# EAGLE schematic ModuleCarrier-xDot (EAGLE 7.7.0)

## Sheet 1 of 2
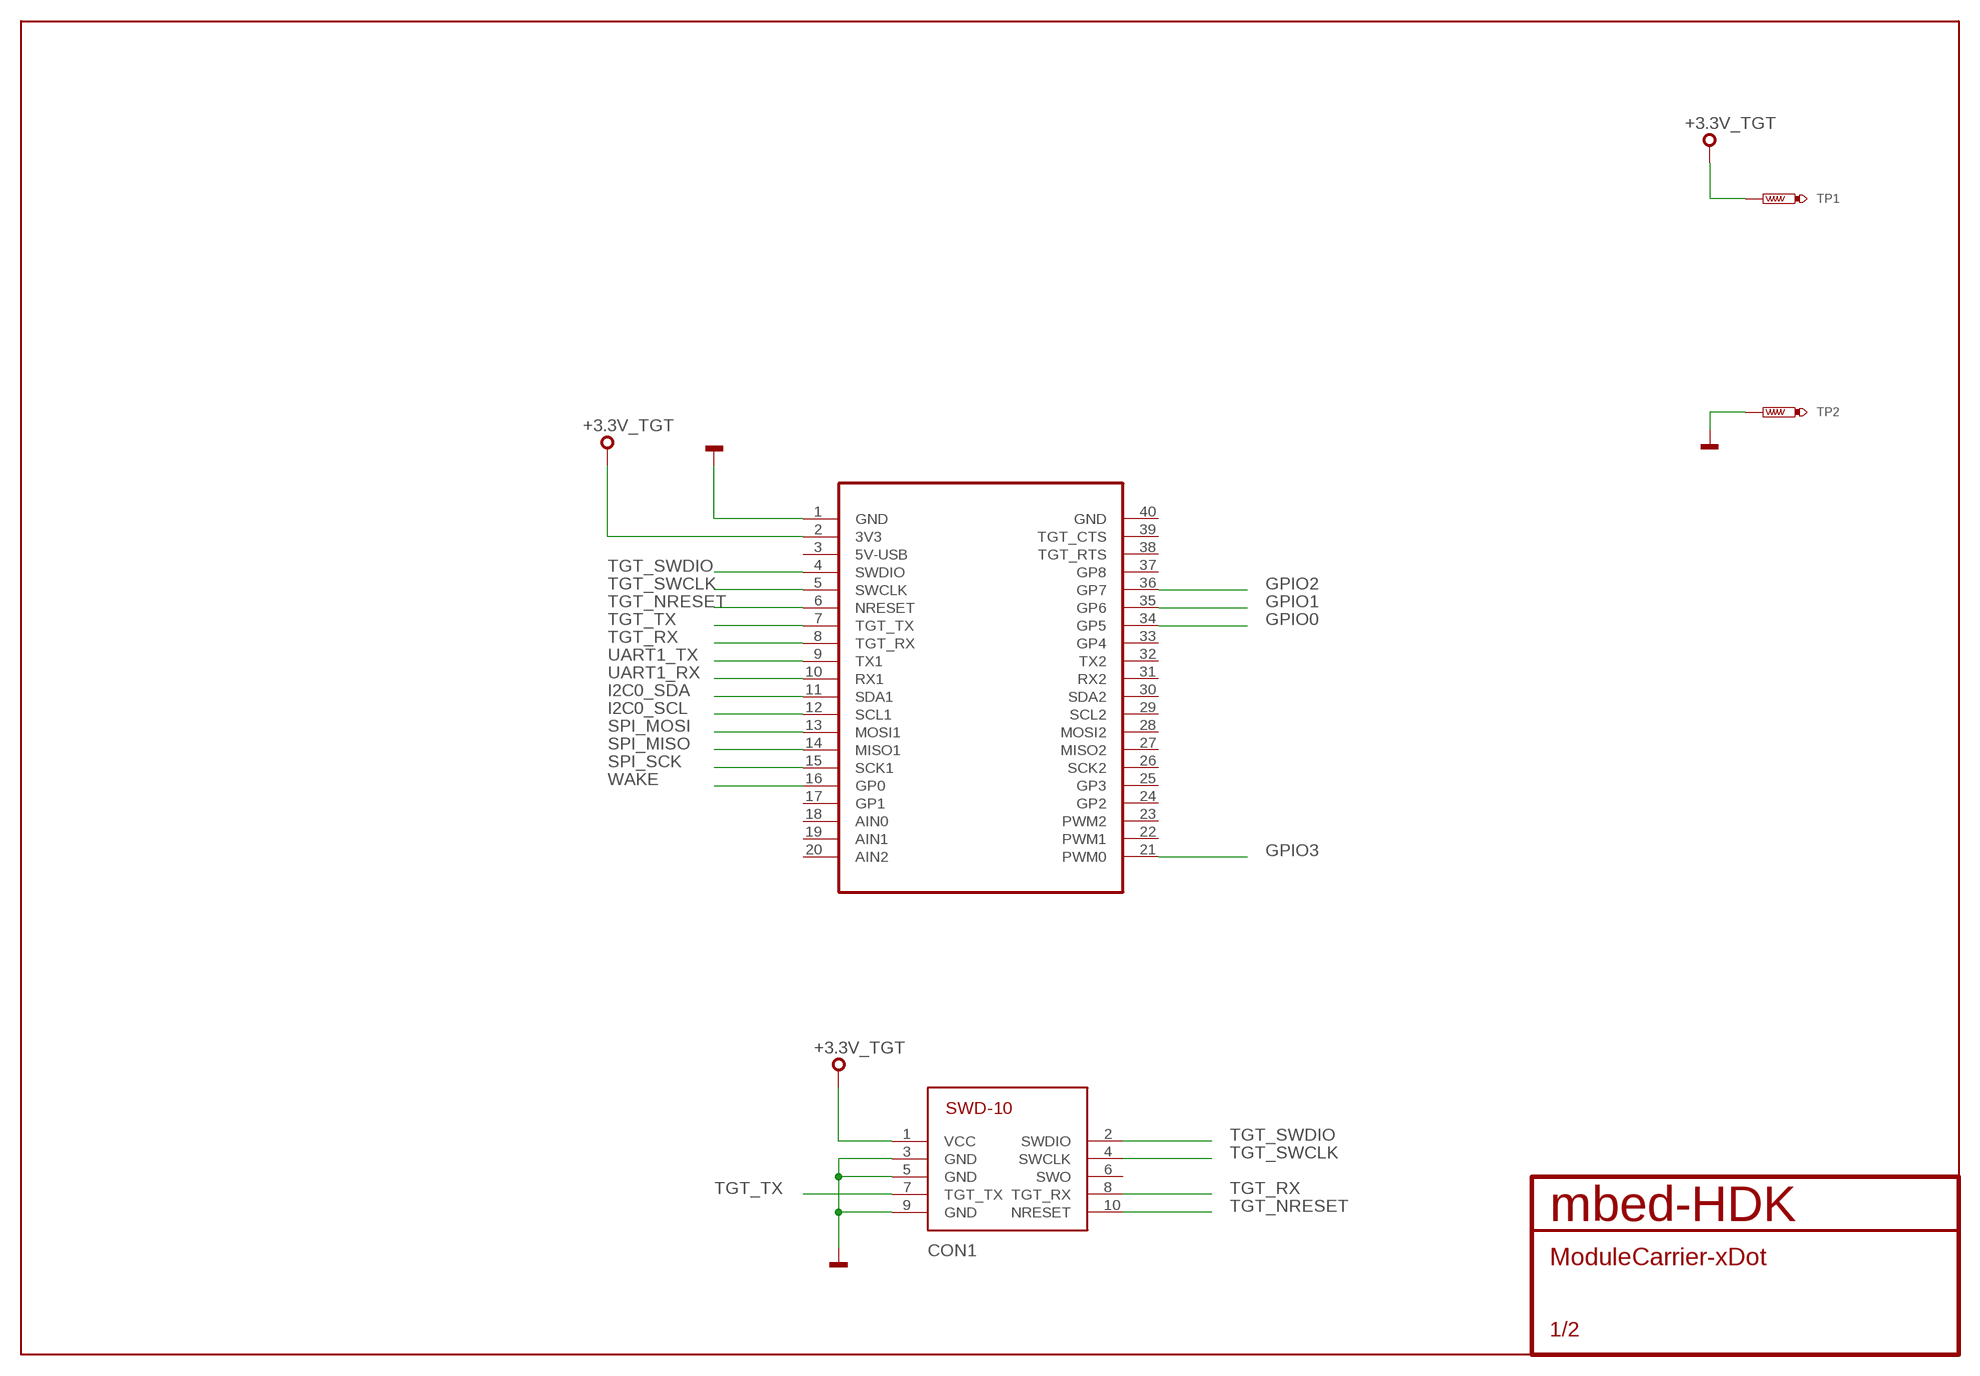
[diagram p0: schematic, sheet 1]

### Parts
CON1  SWD-10/TC2050_SMD  [FTSH-105-02]
TP1  TEST-POINT-50R-PTH  [TP50-PTH]
TP2  TEST-POINT-50R-PTH  [TP50-PTH]
U$1  MODULE_DAUGHTER  [MODULE_DAUGHTER]

### Nets
+3.3V_TGT: CON1.1(VCC) TP1.TP U$1.2(3V3) ; also sheet 2
GND: CON1.3(GND) CON1.5(GND) CON1.9(GND) TP2.TP U$1.1(GND) ; also sheet 2
GPIO0: U$1.34(GP5) ; also sheet 2
GPIO1: U$1.35(GP6) ; also sheet 2
GPIO2: U$1.36(GP7) ; also sheet 2
GPIO3: U$1.21(PWM0) ; also sheet 2
I2C0_SCL: U$1.12(SCL1) ; also sheet 2
I2C0_SDA: U$1.11(SDA1) ; also sheet 2
SPI_MISO: U$1.14(MISO1) ; also sheet 2
SPI_MOSI: U$1.13(MOSI1) ; also sheet 2
SPI_SCK: U$1.15(SCK1) ; also sheet 2
TGT_NRESET: CON1.10(NRESET) U$1.6(NRESET) ; also sheet 2
TGT_RX: CON1.8(TGT_RX) U$1.8(TGT_RX) ; also sheet 2
TGT_SWCLK: CON1.4(SWCLK) U$1.5(SWCLK) ; also sheet 2
TGT_SWDIO: CON1.2(SWDIO) U$1.4(SWDIO) ; also sheet 2
TGT_TX: CON1.7(TGT_TX) U$1.7(TGT_TX) ; also sheet 2
UART1_RX: U$1.10(RX1) ; also sheet 2
UART1_TX: U$1.9(TX1) ; also sheet 2
WAKE: U$1.16(GP0) ; also sheet 2
Unconnected: CON1.6(SWO) U$1.3(5V-USB) U$1.17(GP1) U$1.18(AIN0) U$1.19(AIN1) U$1.20(AIN2) U$1.22(PWM1) U$1.23(PWM2) U$1.24(GP2) U$1.25(GP3) U$1.26(SCK2) U$1.27(MISO2) U$1.28(MOSI2) U$1.29(SCL2) U$1.30(SDA2) U$1.31(RX2) U$1.32(TX2) U$1.33(GP4) U$1.37(GP8) U$1.38(TGT_RTS) U$1.39(TGT_CTS) U$1.40(GND)

## Sheet 2 of 2
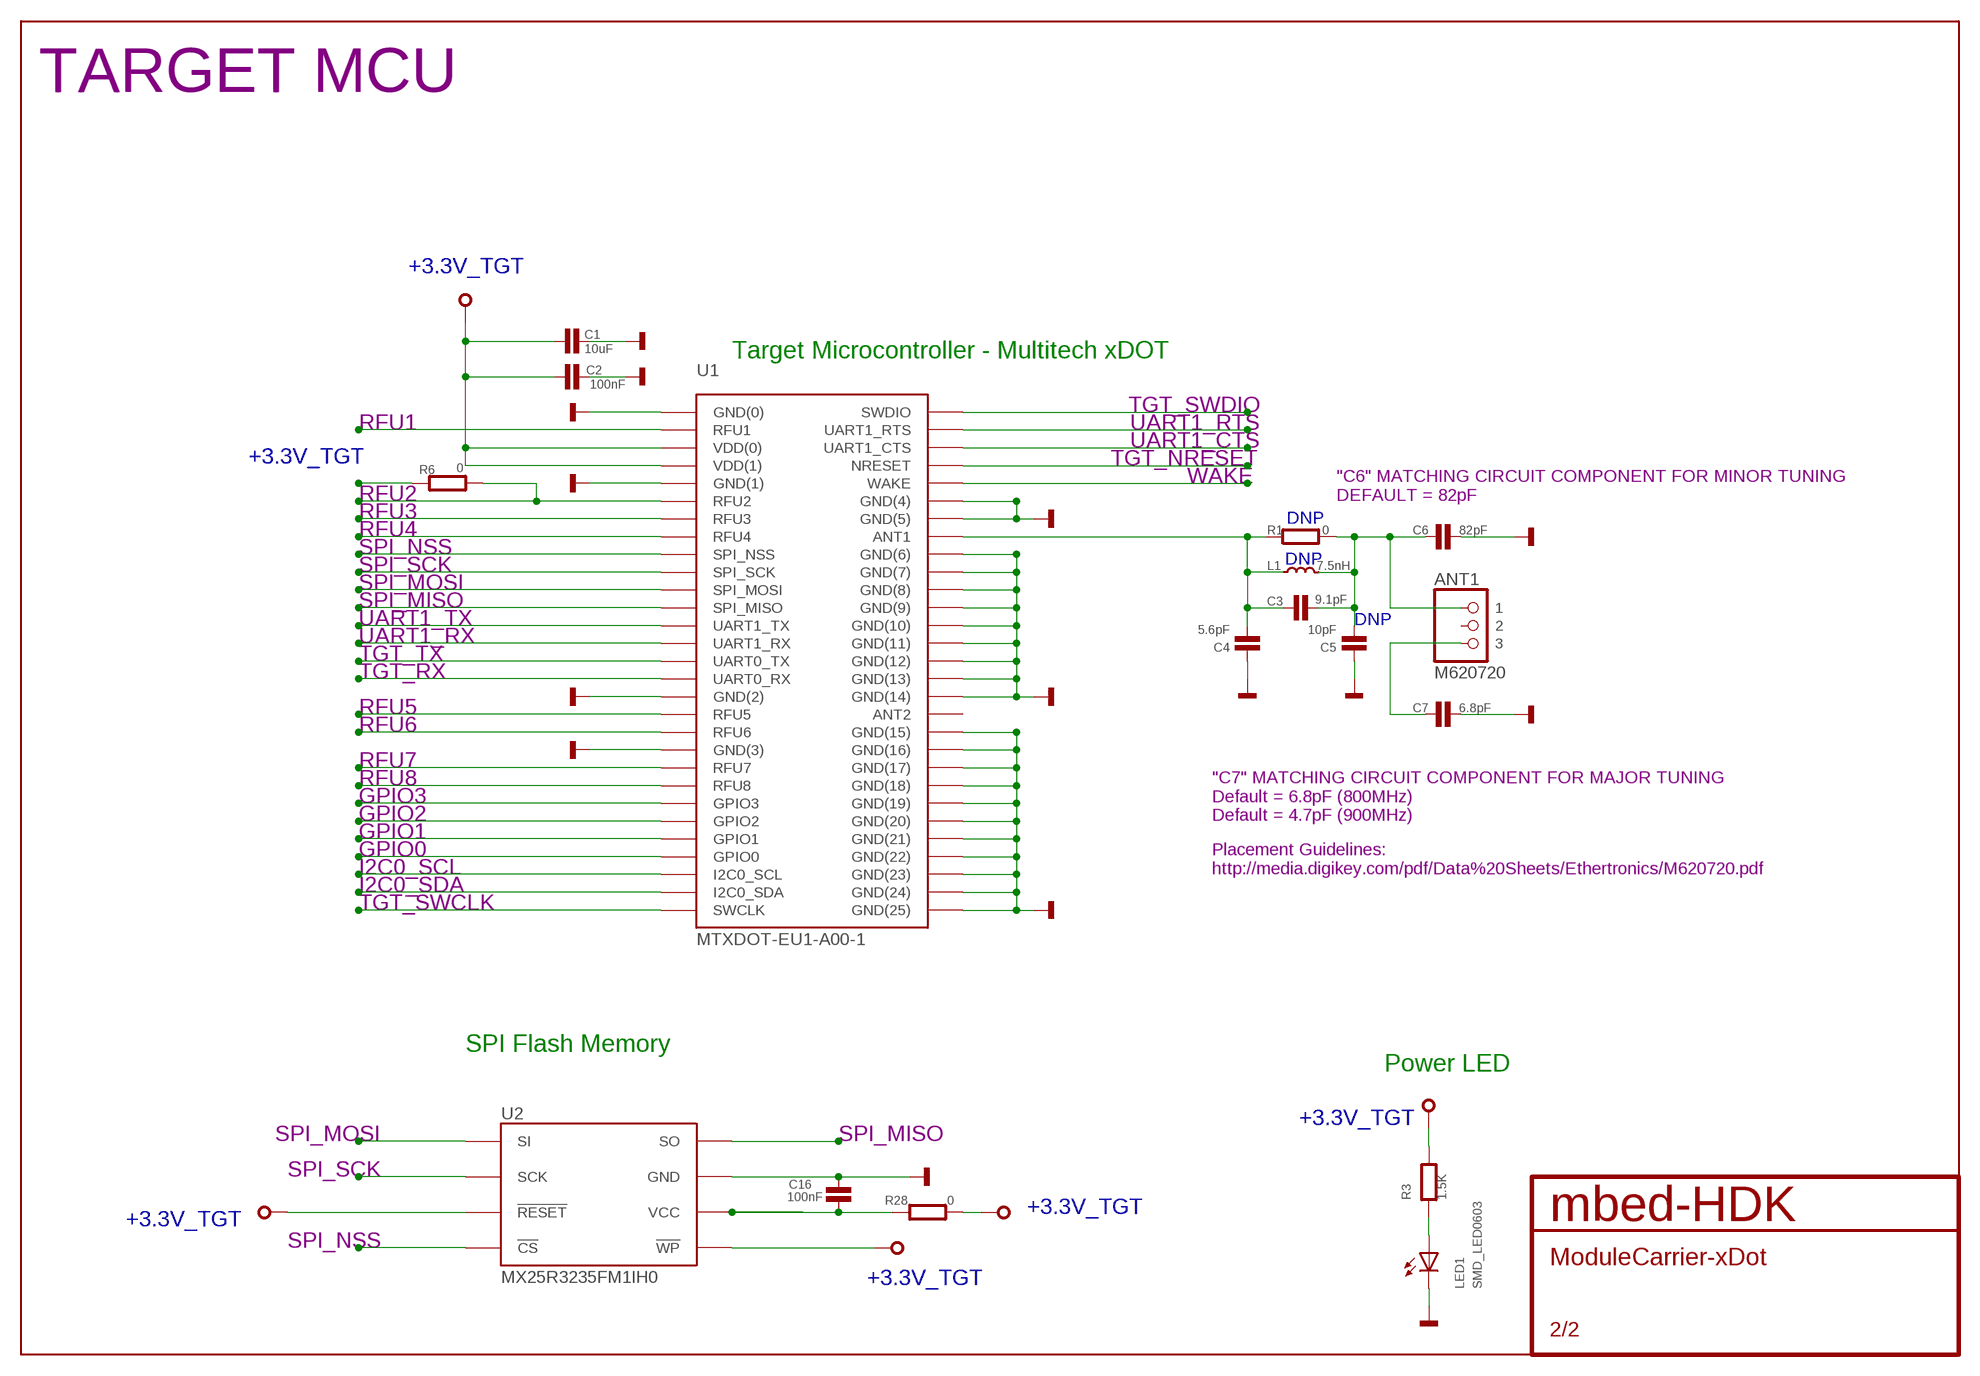
[diagram p1: schematic, sheet 2]

### Parts
ANT1  M620720  [M620720]
C1  10uF  CAPACITOR0603  [0603]
C2  100nF  CAPACITOR0603  [0603]
C3  9.1pF  CAPACITOR0402  [0402]
C4  5.6pF  CAPACITOR0402  [0402]
C5  10pF  CAPACITOR0402  [0402]
C6  82pF  CAPACITOR0402  [0402]
C7  6.8pF  CAPACITOR0402  [0402]
C16  100nF  CAPACITOR0603  [0603]
L1  7.5nH  INDUCTOR0402  [0402]
LED1  SMD_LED0603  [CHIPLED_0603]
R1  0  RESISTOR0402  [0402]
R3  1.5K  RESISTOR0603  [0603]
R6  0  RESISTOR0402  [0402]
R28  0  RESISTOR0603  [0603]
U1  MTXDOT-EU1-A00-1  [MTXDOT-EU1/NA1-A00-1]
U2  MX25R3235FM1IH0  [SO8]

### Nets
+3.3V_TGT: C1.1 C2.1 R3.2 R6.1 R28.2 U1.P$3(VDD(0)) U1.P$4(VDD(1)) U2.3(!WP) U2.7(!RESET) ; also sheet 1
ANT1: C3.1 C4.2 L1.1 R1.1 U1.P$37(ANT1)
GND: C1.2 C2.2 C4.1 C5.1 C6.1 C7.1 C16.1 LED1.C U1.P$1(GND(0)) U1.P$5(GND(1)) U1.P$17(GND(2)) U1.P$20(GND(3)) U1.P$35(GND(4)) U1.P$36(GND(5)) U1.P$38(GND(6)) U1.P$39(GND(7)) U1.P$40(GND(8)) U1.P$41(GND(9)) U1.P$42(GND(10)) U1.P$43(GND(11)) U1.P$44(GND(12)) U1.P$45(GND(13)) U1.P$46(GND(14)) U1.P$48(GND(15)) U1.P$49(GND(16)) U1.P$50(GND(17)) U1.P$51(GND(18)) U1.P$52(GND(19)) U1.P$53(GND(20)) U1.P$54(GND(21)) U1.P$55(GND(22)) U1.P$56(GND(23)) U1.P$57(GND(24)) U1.P$58(GND(25)) U2.4(GND) ; also sheet 1
GPIO0: U1.P$26(GPIO0) ; also sheet 1
GPIO1: U1.P$25(GPIO1) ; also sheet 1
GPIO2: U1.P$24(GPIO2) ; also sheet 1
GPIO3: U1.P$23(GPIO3) ; also sheet 1
I2C0_SCL: U1.P$27(I2C0_SCL) ; also sheet 1
I2C0_SDA: U1.P$28(I2C0_SDA) ; also sheet 1
N$1: ANT1.P$3 C7.2
N$2: LED1.A R3.1
N$4: ANT1.P$1 C3.2 C5.2 C6.2 L1.2 R1.2
N$48: C16.2 R28.1 U2.8(VCC)
RFU1: U1.P$2(RFU1)
RFU2: R6.2 U1.P$6(RFU2)
RFU3: U1.P$7(RFU3)
RFU4: U1.P$8(RFU4)
RFU5: U1.P$18(RFU5)
RFU6: U1.P$19(RFU6)
RFU7: U1.P$21(RFU7)
RFU8: U1.P$22(RFU8)
SPI_MISO: U1.P$12(SPI_MISO) U2.2(SO) ; also sheet 1
SPI_MOSI: U1.P$11(SPI_MOSI) U2.5(SI) ; also sheet 1
SPI_NSS: U1.P$9(SPI_NSS) U2.1(!CS)
SPI_SCK: U1.P$10(SPI_SCK) U2.6(SCK) ; also sheet 1
TGT_NRESET: U1.P$33(NRESET) ; also sheet 1
TGT_RX: U1.P$16(UART0_RX) ; also sheet 1
TGT_SWCLK: U1.P$29(SWCLK) ; also sheet 1
TGT_SWDIO: U1.P$30(SWDIO) ; also sheet 1
TGT_TX: U1.P$15(UART0_TX) ; also sheet 1
UART1_CTS: U1.P$32(UART1_CTS)
UART1_RTS: U1.P$31(UART1_RTS)
UART1_RX: U1.P$14(UART1_RX) ; also sheet 1
UART1_TX: U1.P$13(UART1_TX) ; also sheet 1
WAKE: U1.P$34(WAKE) ; also sheet 1
Unconnected: ANT1.P$2 U1.P$47(ANT2)

### Notes on the sheet
- TARGET MCU
- Target Microcontroller - Multitech xDOT
- "C6" MATCHING CIRCUIT COMPONENT FOR MINOR TUNING
  DEFAULT = 82pF
- DNP
- DNP
- DNP
- "C7" MATCHING CIRCUIT COMPONENT FOR MAJOR TUNING
  Default = 6.8pF (800MHz)
  Default = 4.7pF (900MHz)
- Placement Guidelines:
  http://media.digikey.com/pdf/Data%20Sheets/Ethertronics/M620720.pdf
- SPI Flash Memory
- Power LED

## Library data of the parts
ANT1 = mbed-HDK-RF:M620720: Chip Antenna Ceramic ISM/M2M/IoT 868/915MHz; MF: Ethertronics; MFN: M620720; OC-DIGIKEY: 939-1066-1-ND
C1-C7 C16 = mbed-HDK-RLCQ:CAPACITOR: Capacitor
CON1 = mbed-HDK-Connector:SWD-10/TC2050: 1mm pitch 10-Pin Cortex Programming Header with optional TC2050 footprint solderless interchangeable
L1 = mbed-HDK-RLCQ:INDUCTOR: Inductor
LED1 = mbed-HDK-Optical:SMD_LED: LED SMD, Colour Red; MF: Wurth Electronics Inc; MFN: 150060RS75000; OC-DIGIKEY: 732-4978-1-ND; OC-MOUSER: 710-150060RS75000; OC-NEWARK: 2322071
R1 R3 R6 R28 = mbed-HDK-RLCQ:RESISTOR: Resistor
TP1 TP2 = mbed-HDK:TEST-POINT
U1 = mbed-HDK-MF-MULTITECH:MTXDOT-EU1-A00-1: Multitech xDOT LORA MODULE UFL/TRC 868MHz for Europe; MF: Multi-Tech Systems Inc.; MFN: MTXDOT-EU1-A00-1; OC-DIGIKEY: 591-1292-ND
U2 = mbed-HDK-IC:MX25R3235FM1IH0: Serial Flash 32 Mb 80 Mhz; MF: Macronix; MFN: MX25R3235FM2IH0; OC-DIGIKEY: 1092-1174-ND
U$1 = blackbriar:MODULE_DAUGHTER